# EAGLE design zxld400-9-leds-mk-2-driver (EAGLE 6.5.0)
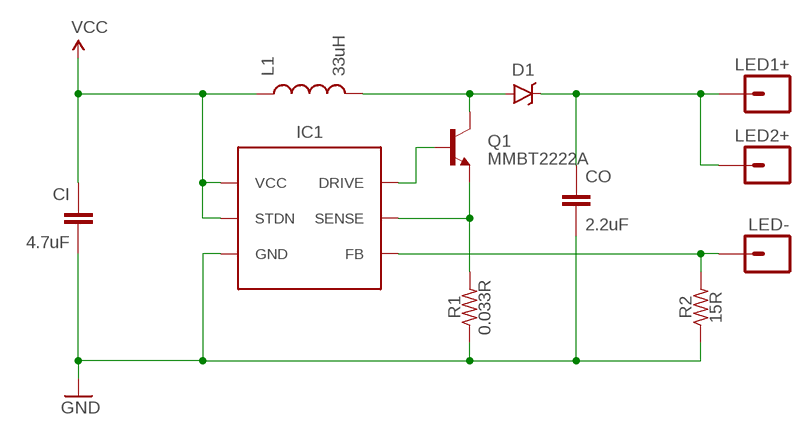
[diagram p0: schematic, sheet 1]

## Parts
CI  4.7uF  CAPACITOR-CERAMICC0805  [C0805]
CO  2.2uF  CAPACITOR-CERAMICC0805  [C0805]
D1  DIODE-SCHOTTKYSMA  [SMA-DIODE-SCHOTTKY]
IC1  ZXSC400  [SOT23-6]
L1  33uH  INDUCTORTAIYO-YUDEN-30XX  [TAIYO-YUDEN-30XX]
LED1+  M01PTH  [1X01]
LED2+  M01PTH  [1X01]
LED-  M01PTH  [1X01]
Q1  MMBT2222A  TRANSISTOR_NPNMMBT2222A  [SOT23-3]
R1  0.033R  RESISTORR0805  [R0805]
R2  15R  RESISTORR0603  [R0603]

## Nets
GND: CI.2 CO.2 IC1.2(GND) R1.1 R2.1
LED+: CO.1 D1.C LED1+.1 LED2+.1
LED-: IC1.5(FB) LED-.1 R2.2
N$1: D1.A L1.2 Q1.3(C)
N$2: IC1.6(DRIVE) Q1.1(B)
N$3: IC1.4(SENSE) Q1.2(E) R1.2
VCC: CI.1 IC1.1(VCC) IC1.3(STDN) L1.1

## Library data of the parts
CI CO = A_butts:CAPACITOR-CERAMIC: CAPACITOR, European symbol
D1 = A_butts:DIODE-SCHOTTKY: Schottky diodes in SFE's production catalog BAT20J 1A 23V 0.62Vf RB751 120mA 40V 0.37Vf PMEG4005EJ 0.5A 40V 0.42Vf MBRA140 1A 40V 0.5Vf B340A 3A 40V SMA
IC1 = A_butts:ZXSC400
L1 = A_butts:INDUCTOR: Inductors Basic Inductor/Choke - 0603 and 1206. Footprints are not proven and vary greatly between part numbers. SRN6045- 33uH, 20% 1.4A SDR0403-560KL - 56uH, 10%, 500mA RMS/740mA peak
LED1+ LED2+ LED- = A_butts:M01: Header 1 Standard 1-pin 0.1" header. Use with straight break away headers (SKU : PRT-00116), right angle break away headers (PRT-00553), swiss pins (PRT-00743), machine pins (PRT-00117), and female headers (PRT-00115).
Q1 = A_butts:TRANSISTOR_NPN: Generic NPN BJT MMBT2222A - TRANS-08049 (SOT-23, 1A 40V) MPSA42 - TRANS-09116 (SOT-23, 500mA 300V) MMBT5088LT1G - TRANS-11160 (SOT-23, 50 mA 30V) BC547 - COM-08928 <http://www.sparkfun.com/products/8928> (TO-92 45V 100mA) (1.Collector 2.Base 3.Emitter) 2N3904 - COM-00521 <http://www.sparkfun.com/products/521> (TO-92 40V 200mA) (1.Emitter 2.Base 3.Collector) P2N2222A - COM-12852 <http://www.sparkfun.com/products/12852> (TO-92 40V 600mA) (1.Collector 2.Base 3.Emitter); PROD_ID: TRANS-08049
R1 R2 = A_butts:RESISTOR: RESISTOR, American symbol

## Board
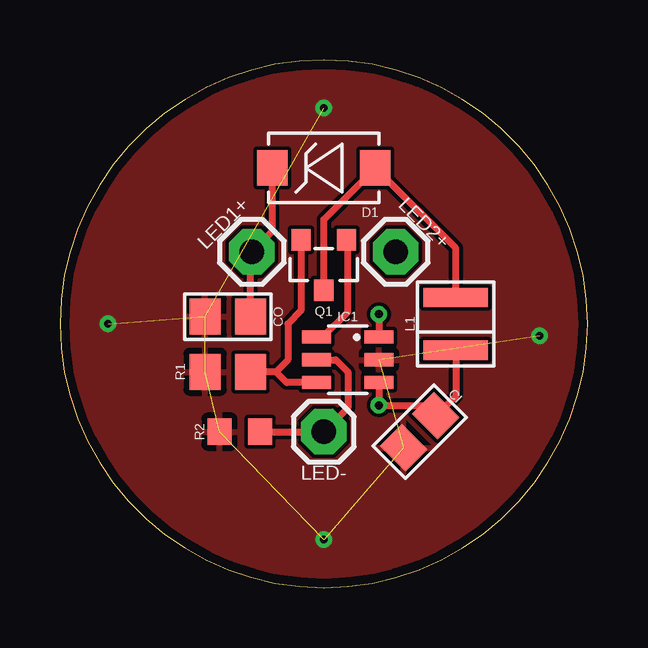
[diagram p1: board, top side]
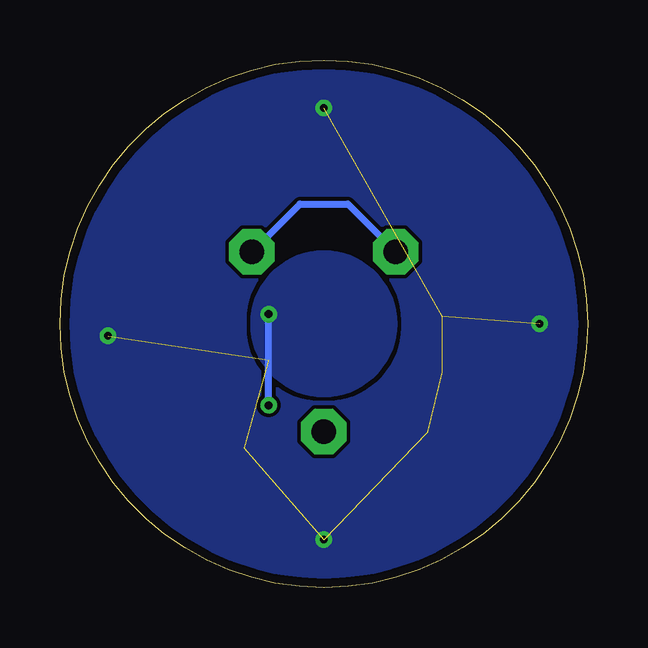
[diagram p2: board, bottom side, seen from below]

Size 22 x 22 mm. Coordinates in mm from the lower left corner, seen from the top.
Outline: 0,11 arc90 11,0 arc90 22,11 arc90 11,22 arc90 0,11
Copper layers (1*16): Top 0.0356mm / dielectric 1.5011mm / Bottom 0.0356mm
Design rules "LaenPCBOrder2": minimum track width 6mil, minimum drill 13mil, track to track 6mil, track to pad 6mil, pad to pad 6mil, via to via 6mil, smd to smd 6mil, copper to edge 15mil, drill to drill 6mil, minimum pad ring 7mil, minimum via ring 7mil, stop-mask expansion 3mil, vias tented up to drill 20mil, thermal gap 10mil

### Footprints (pad centres in the part's own frame; a part is rotated, then mirrored left to right if it is on the bottom)
C0805 = smd 1.3 x 1.5: 1 -0.95,0; 2 0.95,0
SMA-DIODE-SCHOTTKY = smd 1.27 x 1.47: A -2.15,0; C 2.15,0
SOT23-6 = smd 0.55 x 1.2: 1 0.95,-1.3; 2 0,-1.3; 3 -0.95,-1.3; 4 -0.95,1.3; 5 0,1.3; 6 0.95,1.3
TAIYO-YUDEN-30XX = smd 0.8 x 2.7: 1 -1.1,0; 2 1.1,0
1X01 = drill 1.016 pad 1.88 octagon: 1 0,0
SOT23-3 = smd 0.8 x 0.9: 1 -0.95,-1; 2 0.95,-1; 3 0,1.1
R0805 = smd 1.3 x 1.5: 1 -0.95,0; 2 0.95,0
R0603 = smd 1 x 1.1: 1 -0.85,0; 2 0.85,0

### Placement (x,y rotation side)
CI  15,6.5 225 top
CO  7,11.3 180 top
D1  11,17.5 180 top
IC1  12,9.5 90 top
L1  16.5,11 90 top
LED1+  8,14 45 top
LED2+  14,14 315 top
LED-  11,6.5 180 top
Q1  11,13.5 180 top
R1  7,9 0 top
R2  7.5,6.5 0 top

### Tracks (layer width: path | path; a pad name or v marks a point on that pad's centre or on a via)
GND  (via drill 0.33)  (8 unrouted)
  other vias: 11,20 2,11 11,2 20,10.5
  pour Top: 11,0 arc-90 0,11 arc-90 11,22 arc-90 22,11 arc-90
  pour Bottom (rank 6): 11,0 arc-90 0,11 arc-90 11,22 arc-90 22,11 arc-90
LED+
  Top 0.3: CO.1 7.95,13.95 LED1+.1 8.85,14.85 D1.C
  Bottom 0.3: LED2+.1 12,16 10,16 LED1+.1
LED-
  Top 0.3: IC1.5 11.5,9.5 12,9 12,7.5 LED-.1 R2.2
N$1
  Top 0.3: L1.2 16.5,14.15 D1.A 11,15.35 Q1.3
N$2
  Top 0.3: IC1.6 10.95,10.45 12,11.5 12,14.45 Q1.1
N$3
  Top 0.3: Q1.2 10.05,11.55 9.5,11 9.5,9.5 9,9 | 9,9 R1.2 | IC1.4 9.45,8.55 9,9
VCC  (via drill 0.33)
  Top 0.3: v13.3,11.4 | v13.3,11.4 IC1.1 | IC1.3 | IC1.3 v13.3,7.6 15.24,7.6 CI.1 16.5,8 L1.1
  Bottom 0.3: v13.3,7.6 v13.3,11.4
  pour Bottom: 11,8 arc-90 8,11 arc-90 11,14 arc-90 14,11 arc-90